# Altium schematic sheet TopLevel.SchDoc
size A4
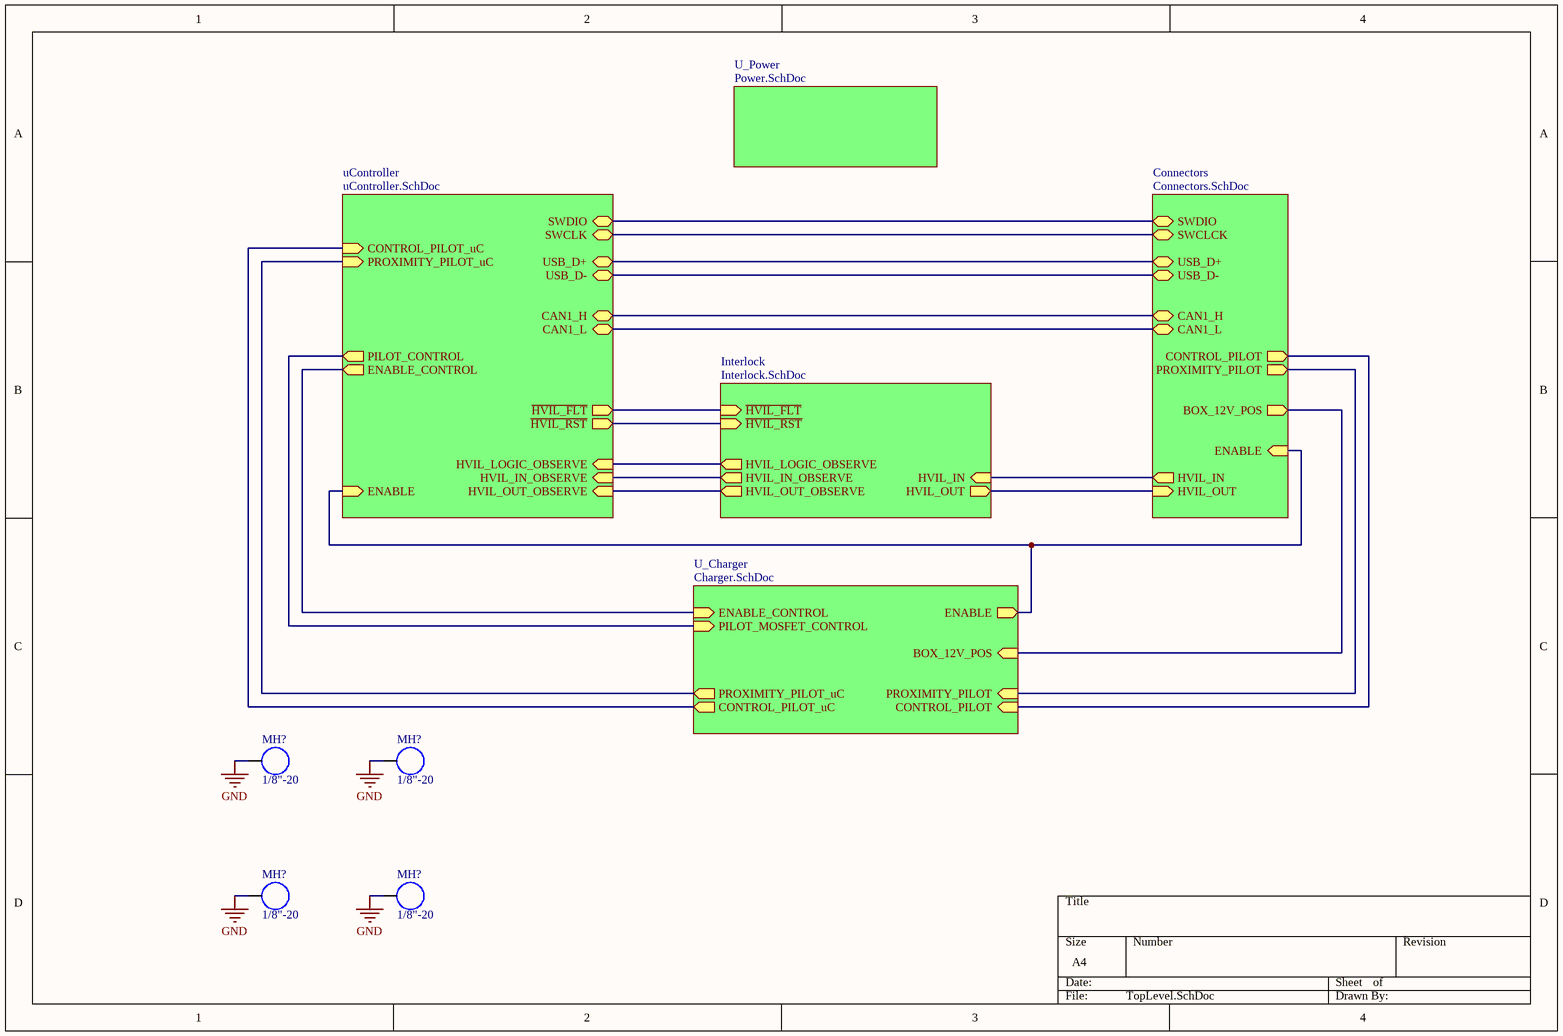
[diagram p0: TopLevel.SchDoc]

## Parts
(Parts that share a designator on the sheet are numbered #1, #2 ... from top to bottom, then left to right.)
MH?#1  1/8"-20  [MOUNTING_HOLE]
MH?#2  1/8"-20  [MOUNTING_HOLE]
MH?#3  1/8"-20  [MOUNTING_HOLE]
MH?#4  1/8"-20  [MOUNTING_HOLE]

## Sub-sheets
Connectors = Connectors.SchDoc: CAN1_L (bidir), SWCLCK (bidir), SWDIO (bidir), USB_D+ (bidir), USB_D- (bidir), HVIL_IN (out), CAN1_H (bidir), HVIL_OUT (in), BOX_12V_POS (out), ENABLE (in), CONTROL_PILOT (out), PROXIMITY_PILOT (out)
Interlock = Interlock.SchDoc: HVIL_OUT_OBSERVE (out), HVIL_OUT (out), ~{HVIL_RST} (in), HVIL_IN (in), HVIL_IN_OBSERVE (out), ~{HVIL_FLT} (in), HVIL_LOGIC_OBSERVE (out)
U_Charger = Charger.SchDoc: CONTROL_PILOT_uC (out), ENABLE (out), BOX_12V_POS (in), CONTROL_PILOT (in), PROXIMITY_PILOT (in), PROXIMITY_PILOT_uC (out), ENABLE_CONTROL (in), PILOT_MOSFET_CONTROL (in)
U_Power = Power.SchDoc: no entries
uController = uController.SchDoc: HVIL_OUT_OBSERVE (in), HVIL_LOGIC_OBSERVE (in), HVIL_IN_OBSERVE (in), USB_D- (bidir), SWDIO (bidir), SWCLK (bidir), ~{HVIL_RST} (out), USB_D+ (bidir), ~{HVIL_FLT} (out), CAN1_H (bidir), CAN1_L (bidir), CONTROL_PILOT_uC (in), ENABLE (in), ENABLE_CONTROL (out), PILOT_CONTROL (out), PROXIMITY_PILOT_uC (in)

## Nets
GND: MH?#1.1 MH?#2.1 MH?#3.1 MH?#4.1
(unnamed): sheet uController/HVIL_OUT_OBSERVE, sheet Interlock/HVIL_OUT_OBSERVE
(unnamed): sheet uController/HVIL_LOGIC_OBSERVE, sheet Interlock/HVIL_LOGIC_OBSERVE
(unnamed): sheet uController/HVIL_IN_OBSERVE, sheet Interlock/HVIL_IN_OBSERVE
(unnamed): sheet uController/USB_D-, sheet Connectors/USB_D-
(unnamed): sheet uController/SWDIO, sheet Connectors/SWDIO
(unnamed): sheet uController/SWCLK, sheet Connectors/SWCLCK
(unnamed): sheet uController/~{HVIL_RST}, sheet Interlock/~{HVIL_RST}
(unnamed): sheet uController/USB_D+, sheet Connectors/USB_D+
(unnamed): sheet uController/~{HVIL_FLT}, sheet Interlock/~{HVIL_FLT}
(unnamed): sheet uController/CAN1_H, sheet Connectors/CAN1_H
(unnamed): sheet uController/CAN1_L, sheet Connectors/CAN1_L
(unnamed): sheet uController/CONTROL_PILOT_uC, sheet U_Charger/CONTROL_PILOT_uC
(unnamed): sheet uController/ENABLE, sheet Connectors/ENABLE, sheet U_Charger/ENABLE
(unnamed): sheet uController/ENABLE_CONTROL, sheet U_Charger/ENABLE_CONTROL
(unnamed): sheet uController/PILOT_CONTROL, sheet U_Charger/PILOT_MOSFET_CONTROL
(unnamed): sheet uController/PROXIMITY_PILOT_uC, sheet U_Charger/PROXIMITY_PILOT_uC
(unnamed): sheet Connectors/HVIL_IN, sheet Interlock/HVIL_IN
(unnamed): sheet Connectors/HVIL_OUT, sheet Interlock/HVIL_OUT
(unnamed): sheet Connectors/BOX_12V_POS, sheet U_Charger/BOX_12V_POS
(unnamed): sheet Connectors/CONTROL_PILOT, sheet U_Charger/CONTROL_PILOT
(unnamed): sheet Connectors/PROXIMITY_PILOT, sheet U_Charger/PROXIMITY_PILOT

## Library data of the parts
MH?#1-MH?#4 = Mounting Hole: Mounting Hole for 1/8"-20 Thread Size, 1-1/8" Long Black-Oxide Alloy Steel Socket Head Screw; Screw Specs: https://www.mcmaster.com/91251A560/